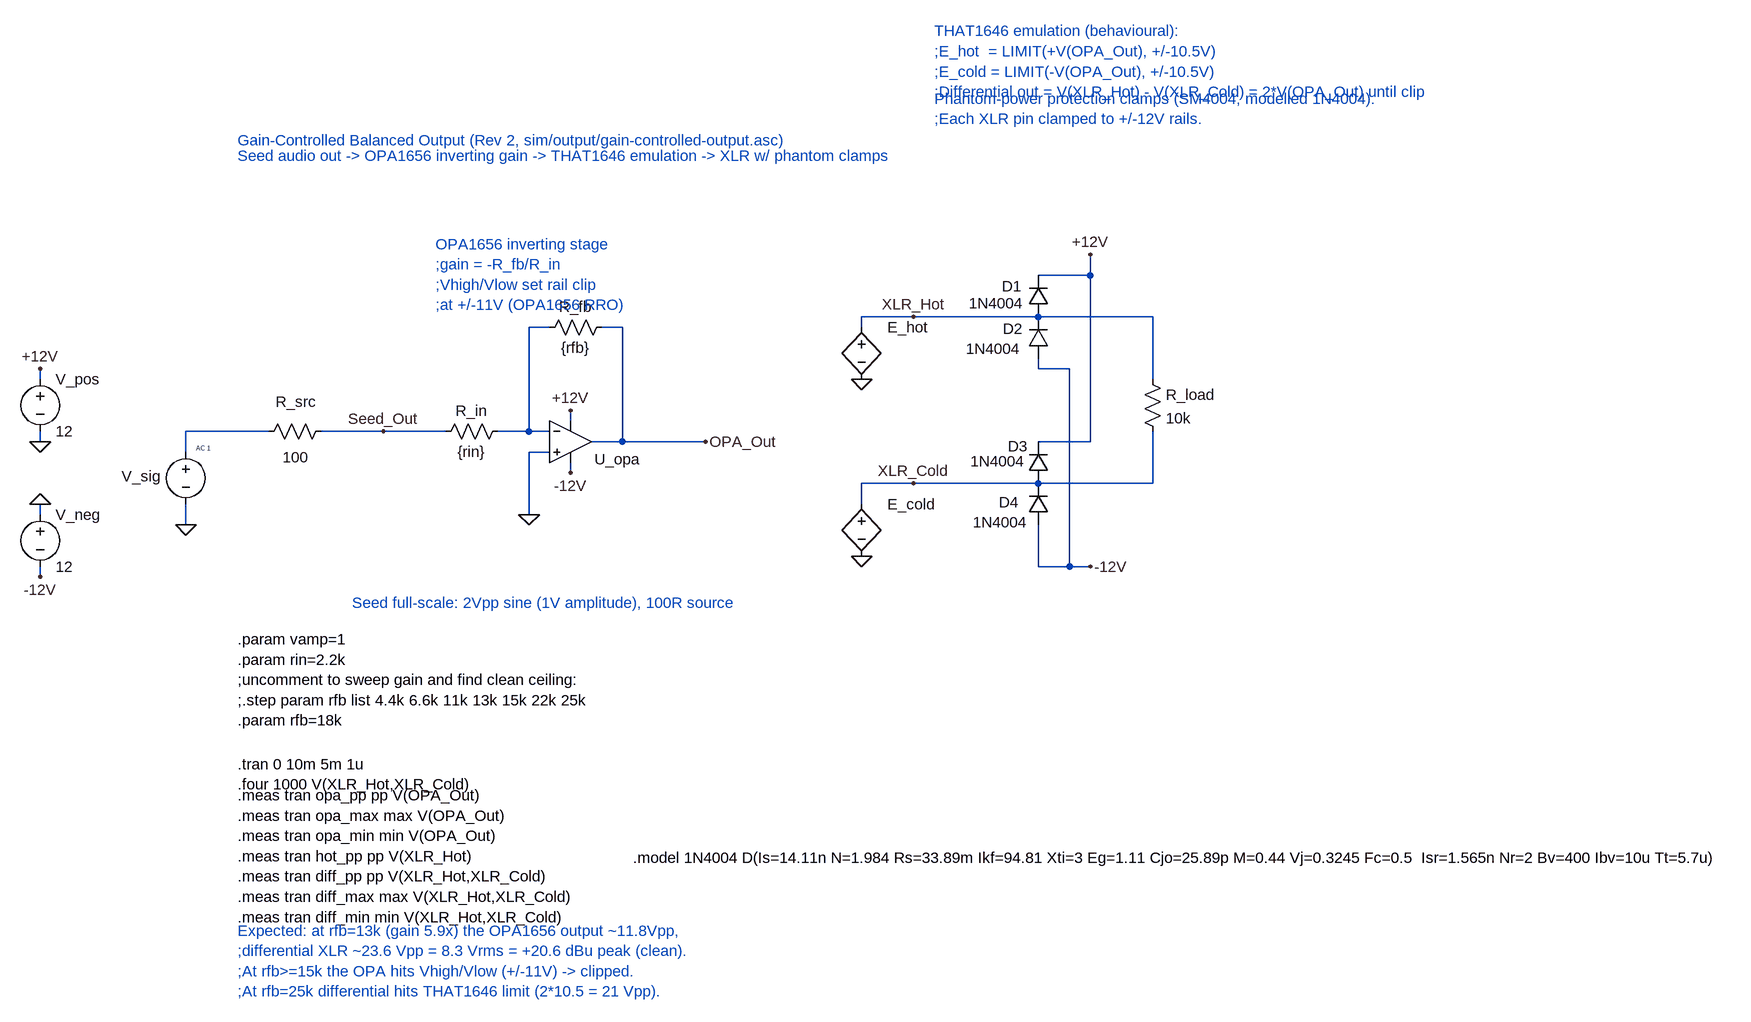
[diagram p0: schematic gain-controlled-output.asc]
gain-controlled-output.asc, the LTspice schematic file:
Version 4
SHEET 1 2220 1400
WIRE 1184 160 1184 128
WIRE 1184 160 1104 160
WIRE 912 224 832 224
WIRE 1104 224 912 224
WIRE 1280 224 1104 224
WIRE 352 240 320 240
WIRE 464 240 432 240
WIRE 832 240 832 224
WIRE 1104 304 1104 288
WIRE 1152 304 1104 304
WIRE -432 320 -432 304
WIRE 1280 320 1280 224
WIRE 384 384 384 368
WIRE -80 400 -208 400
WIRE 96 400 0 400
WIRE 192 400 96 400
WIRE 320 400 320 240
WIRE 320 400 272 400
WIRE 352 400 320 400
WIRE -432 416 -432 400
WIRE 464 416 464 240
WIRE 464 416 416 416
WIRE 592 416 464 416
WIRE 1184 416 1184 160
WIRE 1184 416 1104 416
WIRE -208 432 -208 400
WIRE 352 432 320 432
WIRE 384 464 384 448
WIRE 912 480 832 480
WIRE 1104 480 912 480
WIRE 1280 480 1280 400
WIRE 1280 480 1104 480
WIRE 832 512 832 480
WIRE -432 528 -432 512
WIRE 320 528 320 432
WIRE -208 544 -208 512
WIRE 1104 608 1104 544
WIRE 1152 608 1152 304
WIRE 1152 608 1104 608
WIRE 1184 608 1152 608
WIRE -432 624 -432 608
FLAG -432 304 +12V
FLAG -432 416 0
FLAG -208 544 0
FLAG -432 624 -12V
FLAG -432 512 0
FLAG 320 528 0
FLAG 592 416 OPA_Out
FLAG 912 224 XLR_Hot
FLAG 912 480 XLR_Cold
FLAG 1184 128 +12V
FLAG 1184 608 -12V
FLAG 96 400 Seed_Out
FLAG 384 368 +12V
FLAG 384 464 -12V
FLAG 832 592 0
FLAG 832 320 0
SYMBOL voltage -432 304 R0
WINDOW 123 0 0 Left 0
WINDOW 39 0 0 Left 0
SYMATTR InstName V_pos
SYMATTR Value 12
SYMBOL voltage -432 512 R0
WINDOW 123 0 0 Left 0
WINDOW 39 0 0 Left 0
SYMATTR InstName V_neg
SYMATTR Value 12
SYMBOL voltage -208 416 R0
WINDOW 3 24 104 Invisible 2
WINDOW 123 16 10 Left 0
WINDOW 39 0 0 Left 0
WINDOW 0 -99 53 Left 2
SYMATTR Value SINE(0 {vamp} 1000)
SYMATTR Value2 AC 1
SYMATTR InstName V_sig
SYMBOL res -96 416 R270
WINDOW 0 46 58 VTop 2
WINDOW 3 -8 57 VBottom 2
SYMATTR InstName R_src
SYMATTR Value 100
SYMBOL res 176 416 R270
WINDOW 0 32 56 VTop 2
WINDOW 3 0 56 VBottom 2
SYMATTR InstName R_in
SYMATTR Value {rin}
SYMBOL res 336 256 R270
WINDOW 0 32 56 VTop 2
WINDOW 3 0 56 VBottom 2
SYMATTR InstName R_fb
SYMATTR Value {rfb}
SYMBOL UniversalOpAmp2 384 416 R0
WINDOW 0 37 27 Left 2
SYMATTR InstName U_opa
SYMATTR Value2 Avol=1Meg GBW=53Meg Slew=24Meg Vhigh=11 Vlow=-11
SYMBOL bv 832 224 R0
WINDOW 0 40 16 Left 2
WINDOW 3 40 40 Invisible 2
SYMATTR InstName E_hot
SYMATTR Value V=if(V(OPA_Out)>10.5,10.5,if(V(OPA_Out)<-10.5,-10.5,V(OPA_Out)))
SYMBOL bv 832 496 R0
WINDOW 0 40 16 Left 2
WINDOW 3 440 441 Invisible 2
SYMATTR InstName E_cold
SYMATTR Value V=if(-V(OPA_Out)>10.5,10.5,if(-V(OPA_Out)<-10.5,-10.5,-V(OPA_Out)))
SYMBOL res 1264 304 R0
SYMATTR InstName R_load
SYMATTR Value 10k
SYMBOL diode 1120 224 R180
WINDOW 0 41 47 Left 2
WINDOW 3 38 21 Left 2
SYMATTR InstName D1
SYMATTR Value 1N4004
SYMBOL diode 1120 288 R180
WINDOW 0 40 46 Left 2
WINDOW 3 43 15 Left 2
SYMATTR InstName D2
SYMATTR Value 1N4004
SYMBOL diode 1120 480 R180
WINDOW 0 32 57 Left 2
WINDOW 3 36 34 Left 2
SYMATTR InstName D3
SYMATTR Value 1N4004
SYMBOL diode 1120 544 R180
WINDOW 0 46 35 Left 2
WINDOW 3 32 4 Left 2
SYMATTR InstName D4
SYMATTR Value 1N4004
TEXT -128 -48 Left 2 ;Gain-Controlled Balanced Output (Rev 2, sim/output/gain-controlled-output.asc)
TEXT -128 -24 Left 2 ;Seed audio out -> OPA1656 inverting gain -> THAT1646 emulation -> XLR w/ phantom clamps
TEXT 48 664 Left 2 ;Seed full-scale: 2Vpp sine (1V amplitude), 100R source
TEXT 176 112 Left 2 ;OPA1656 inverting stage\n;gain = -R_fb/R_in\n;Vhigh/Vlow set rail clip\n;at +/-11V (OPA1656 RRO)
TEXT 944 -216 Left 2 ;THAT1646 emulation (behavioural):\n;E_hot  = LIMIT(+V(OPA_Out), +/-10.5V)\n;E_cold = LIMIT(-V(OPA_Out), +/-10.5V)\n;Differential out = V(XLR_Hot) - V(XLR_Cold) = 2*V(OPA_Out) until clip
TEXT 944 -112 Left 2 ;Phantom-power protection clamps (SM4004, modelled 1N4004).\n;Each XLR pin clamped to +/-12V rails.
TEXT -128 720 Left 2 !.param vamp=1\n.param rin=2.2k\n;uncomment to sweep gain and find clean ceiling:\n;.step param rfb list 4.4k 6.6k 11k 13k 15k 22k 25k\n.param rfb=18k
TEXT -128 912 Left 2 !.tran 0 10m 5m 1u\n.four 1000 V(XLR_Hot,XLR_Cold)
TEXT -128 960 Left 2 !.meas tran opa_pp pp V(OPA_Out)\n.meas tran opa_max max V(OPA_Out)\n.meas tran opa_min min V(OPA_Out)\n.meas tran hot_pp pp V(XLR_Hot)\n.meas tran diff_pp pp V(XLR_Hot,XLR_Cold)\n.meas tran diff_max max V(XLR_Hot,XLR_Cold)\n.meas tran diff_min min V(XLR_Hot,XLR_Cold)
TEXT -128 1168 Left 2 ;Expected: at rfb=13k (gain 5.9x) the OPA1656 output ~11.8Vpp,\n;differential XLR ~23.6 Vpp = 8.3 Vrms = +20.6 dBu peak (clean).\n;At rfb>=15k the OPA hits Vhigh/Vlow (+/-11V) -> clipped.\n;At rfb=25k differential hits THAT1646 limit (2*10.5 = 21 Vpp).
TEXT 480 1056 Left 2 !.model 1N4004 D(Is=14.11n N=1.984 Rs=33.89m Ikf=94.81 Xti=3 Eg=1.11 Cjo=25.89p M=0.44 Vj=0.3245 Fc=0.5  Isr=1.565n Nr=2 Bv=400 Ibv=10u Tt=5.7u)

The netlist it stands for:
* gain-controlled-output.asc
V_pos +12V 0 12
V_neg 0 -12V 12
V_sig N002 0 SINE(0 {vamp} 1000) AC 1
R_src N002 Seed_Out 100
R_in Seed_Out N001 {rin}
R_fb N001 OPA_Out {rfb}
XU_opa 0 N001 +12V -12V OPA_Out level2 Avol=1Meg GBW=53Meg Slew=24Meg Vhigh=11 Vlow=-11 Ilimit=25m Rail=0 Vos=0 En=0 Enk=0 In=0 Ink=0 Rin=500Meg  ; pins In+ In- V+ V- OUT
B§E_hot XLR_Hot 0 V=if(V(OPA_Out)>10.5,10.5,if(V(OPA_Out)<-10.5,-10.5,V(OPA_Out)))
B§E_cold XLR_Cold 0 V=if(-V(OPA_Out)>10.5,10.5,if(-V(OPA_Out)<-10.5,-10.5,-V(OPA_Out)))
R_load XLR_Hot XLR_Cold 10k
D1 XLR_Hot +12V 1N4004
D2 -12V XLR_Hot 1N4004
D3 XLR_Cold +12V 1N4004
D4 -12V XLR_Cold 1N4004
.model D D
.lib standard.dio
* Gain-Controlled Balanced Output (Rev 2, sim/output/gain-controlled-output.asc)
* Seed audio out -> OPA1656 inverting gain -> THAT1646 emulation -> XLR w/ phantom clamps
* Seed full-scale: 2Vpp sine (1V amplitude), 100R source
* OPA1656 inverting stage
* ;gain = -R_fb/R_in
* ;Vhigh/Vlow set rail clip
* ;at +/-11V (OPA1656 RRO)
* THAT1646 emulation (behavioural):
* ;E_hot  = LIMIT(+V(OPA_Out), +/-10.5V)
* ;E_cold = LIMIT(-V(OPA_Out), +/-10.5V)
* ;Differential out = V(XLR_Hot) - V(XLR_Cold) = 2*V(OPA_Out) until clip
* Phantom-power protection clamps (SM4004, modelled 1N4004).
* ;Each XLR pin clamped to +/-12V rails.
.param vamp=1
.param rin=2.2k
;uncomment to sweep gain and find clean ceiling:
;.step param rfb list 4.4k 6.6k 11k 13k 15k 22k 25k
.param rfb=18k
.tran 0 10m 5m 1u
.four 1000 V(XLR_Hot,XLR_Cold)
.meas tran opa_pp pp V(OPA_Out)
.meas tran opa_max max V(OPA_Out)
.meas tran opa_min min V(OPA_Out)
.meas tran hot_pp pp V(XLR_Hot)
.meas tran diff_pp pp V(XLR_Hot,XLR_Cold)
.meas tran diff_max max V(XLR_Hot,XLR_Cold)
.meas tran diff_min min V(XLR_Hot,XLR_Cold)
* Expected: at rfb=13k (gain 5.9x) the OPA1656 output ~11.8Vpp,
* ;differential XLR ~23.6 Vpp = 8.3 Vrms = +20.6 dBu peak (clean).
* ;At rfb>=15k the OPA hits Vhigh/Vlow (+/-11V) -> clipped.
* ;At rfb=25k differential hits THAT1646 limit (2*10.5 = 21 Vpp).
.model 1N4004 D(Is=14.11n N=1.984 Rs=33.89m Ikf=94.81 Xti=3 Eg=1.11 Cjo=25.89p M=0.44 Vj=0.3245 Fc=0.5  Isr=1.565n Nr=2 Bv=400 Ibv=10u Tt=5.7u)
.lib UniversalOpAmp2.lib
.backanno
.end